# Altium schematic sheet System_architecture.SchDoc
size A3; SheetNumber: 1; SheetTotal: 1
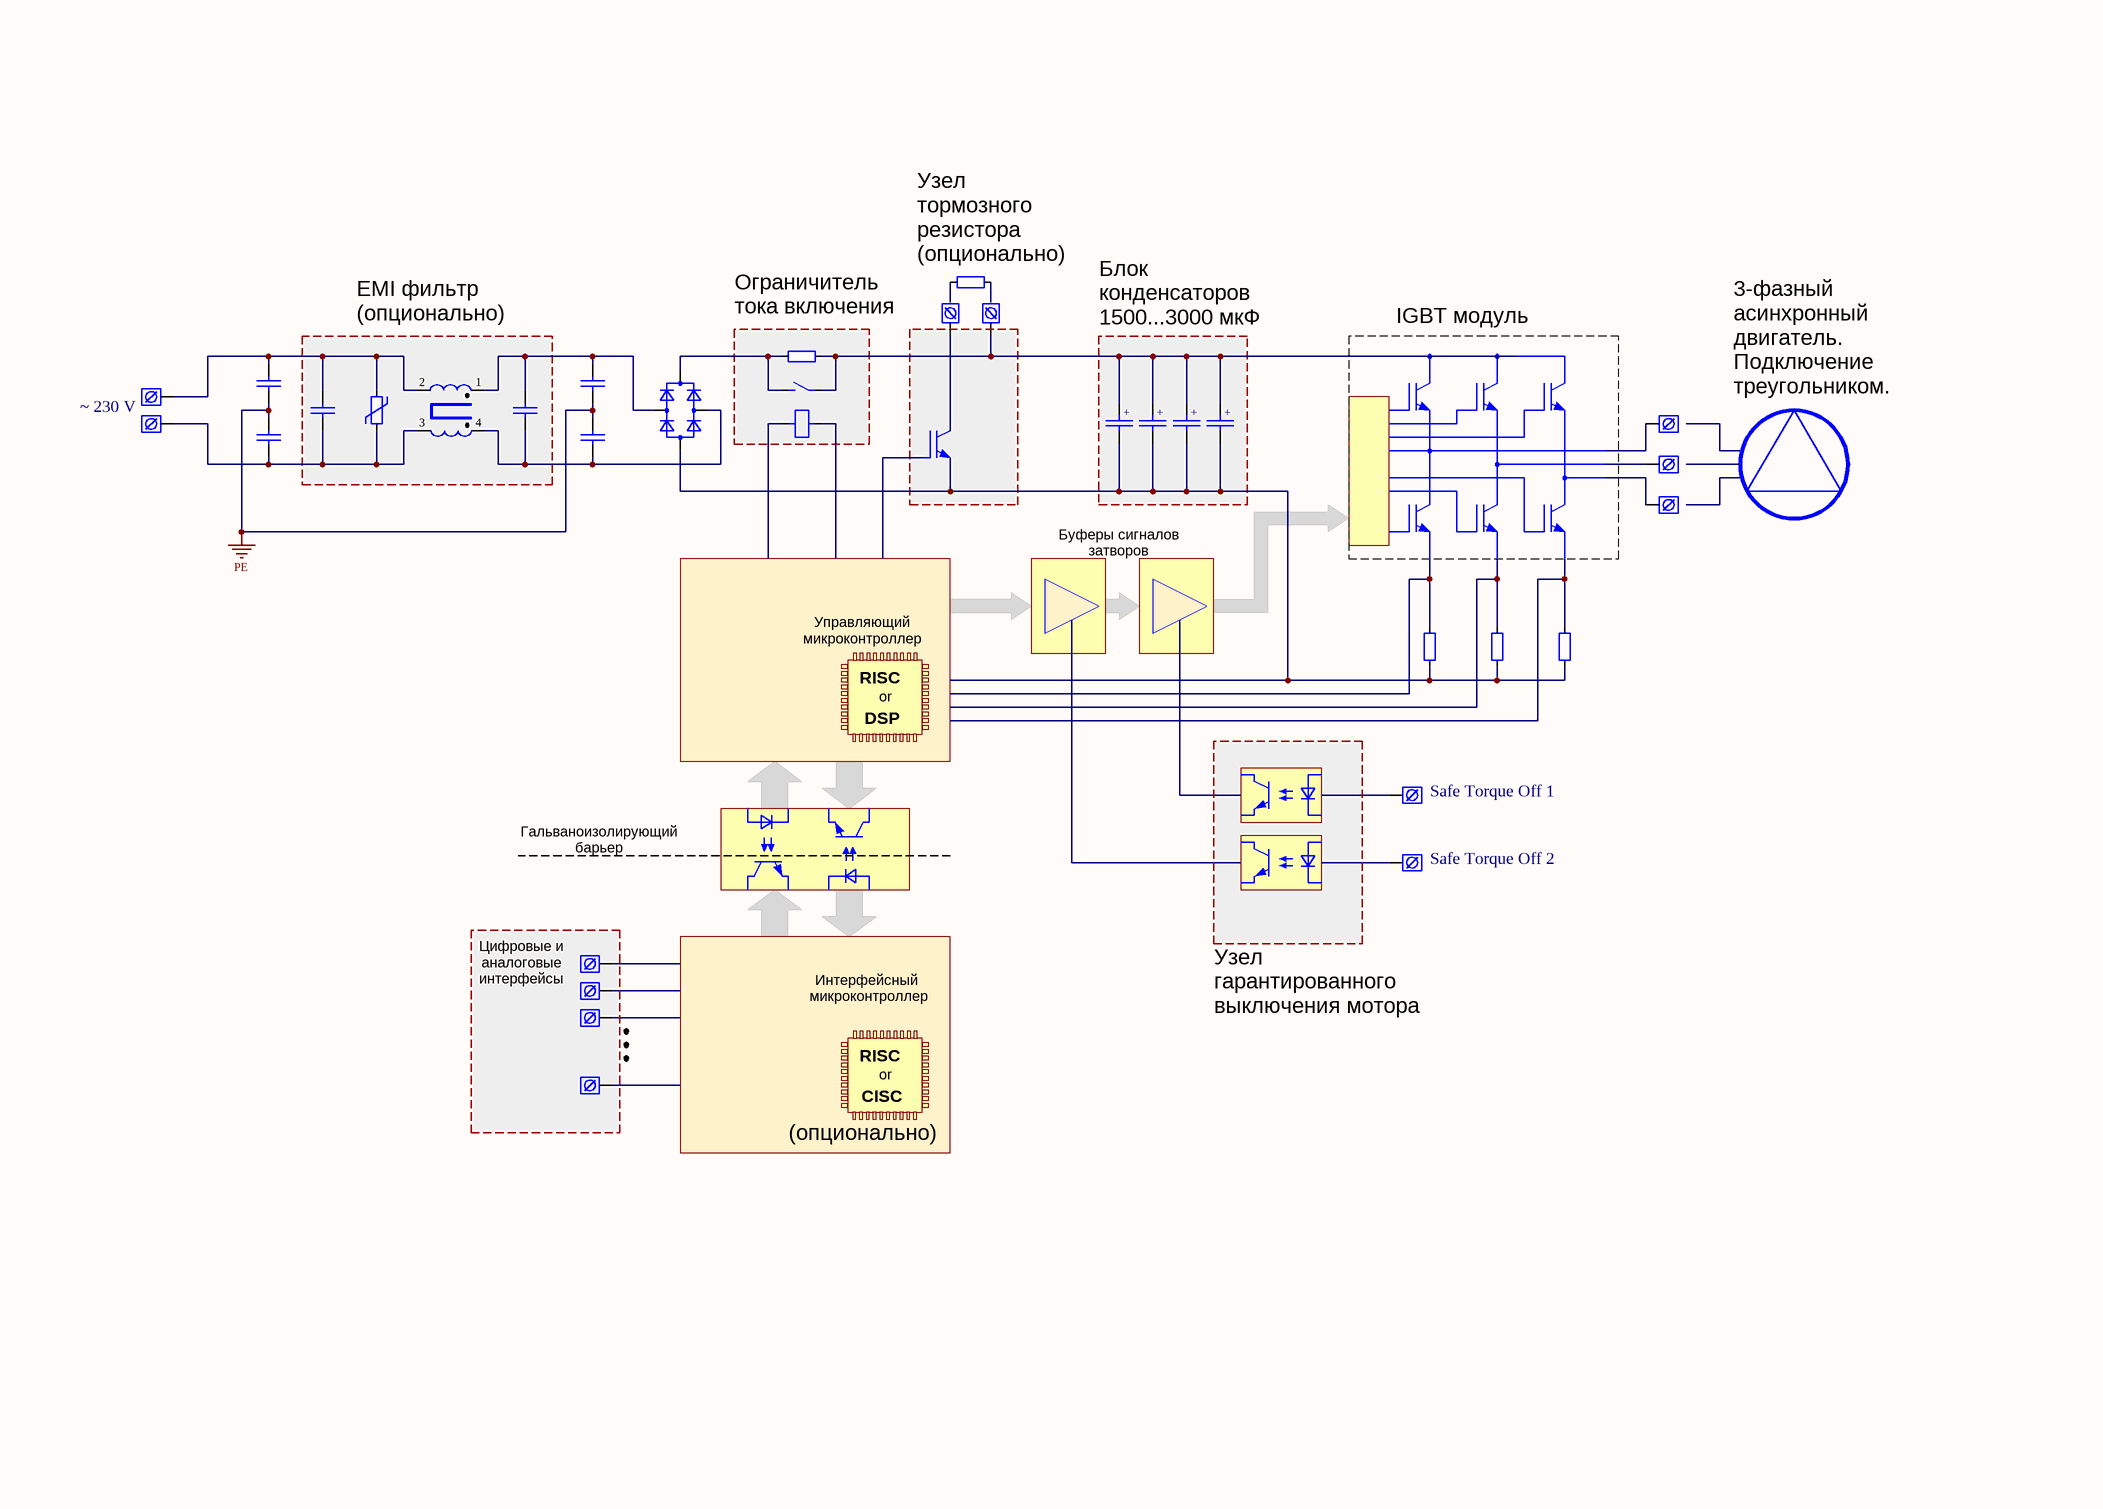
[diagram p0: System_architecture.SchDoc]

## Parts
(Parts that share a designator on the sheet are numbered #1, #2 ... from top to bottom, then left to right.)
*  IGBT_module  (value not drawn)
C1  DE2E3KH472MA3B  [DE2E3KH472M]  (value not drawn)
C2  CY2V-1N5  [CY2V-1N5]  (value not drawn)
C3  JFV-220N/275-P15  [JFV-220N/275-P15]  (value not drawn)
C4  JFV-330N/275-P15  [JFV-330N/275-P15]  (value not drawn)
C5  DE2E3KH472MA3B  [DE2E3KH472M]  (value not drawn)
C6  CY2V-1N5  [CY2V-1N5]  (value not drawn)
C?#1  ESMH451VNN471MA50T  [ESMH451VNN471MA50T]  (value not drawn)
C?#2  ESMH451VNN471MA50T  [ESMH451VNN471MA50T]  (value not drawn)
C?#3  ESMH451VNN471MA50T  [ESMH451VNN471MA50T]  (value not drawn)
C?#4  ESMH451VNN471MA50T  [ESMH451VNN471MA50T]  (value not drawn)
D?  2W04GM  [2W04GM]  (value not drawn)
K1  V23047-A1024-A511  [SR2M]  (value not drawn)  (parts A,B of 3)
K?#1  KEYS7692  [KEYS7692]  (value not drawn)
K?#2  KEYS7692  [KEYS7692]  (value not drawn)
K?#3  KEYS7692  [KEYS7692]  (value not drawn)
K?#4  KEYS7692  [KEYS7692]  (value not drawn)
K?#5  KEYS7692  [KEYS7692]  (value not drawn)
K?#6  KEYS7692  [KEYS7692]  (value not drawn)
K?#7  KEYS7692  [KEYS7692]  (value not drawn)
K?#8  KEYS7692  [KEYS7692]  (value not drawn)
K?#9  KEYS7692  [KEYS7692]  (value not drawn)
K?#10  KEYS7692  [KEYS7692]  (value not drawn)
K?#11  KEYS7692  [KEYS7692]  (value not drawn)
K?#12  KEYS7692  [KEYS7692]  (value not drawn)
K?#13  KEYS7692  [KEYS7692]  (value not drawn)
L1  CMT-8120  [CMT-8120]  (value not drawn)
R1  ERZV14D471  [ERZ-V14D471]  (value not drawn)
R?#1  MCS3264R005FER  [MCS3264]  (value not drawn)
R?#2  MCS3264R005FER  [MCS3264]  (value not drawn)
R?#3  MCS3264R005FER  [MCS3264]  (value not drawn)
R?#4  MCS3264R005FER  [MCS3264]  (value not drawn)
R?#5  MCS3264R005FER  [MCS3264]  (value not drawn)

## Nets
PE: C1.2 C2.2 C5.1 C6.1
NetC1_1: C1.1 C4.1 K?#3.1 L1.2 R1.2
NetC2_1: C2.1 C3.1 D?.2(AC2) L1.1
NetC3_2: C3.2 C6.2 D?.4(AC1) L1.4
NetC4_2: C4.2 C5.2 K?#4.1 L1.3 R1.1
NetC?#1_1: C?#1.1 C?#2.1 C?#3.1 C?#4.1 K1.13 K?#2.1 R?#2.2
NetC?#1_2: C?#1.2 C?#2.2 C?#3.2 C?#4.2 D?.3(-) R?#3.1 R?#4.1 R?#5.1
NetD?_1: D?.1(+) K1.14 R?#2.1

Not connected (* = marked no-connect by the designer): K1 A1 A2; K?#1 1; K?#5 1; K?#6 1; K?#7 1; K?#8 1; K?#9 1; K?#10 1; K?#11 1; K?#12 1; K?#13 1; R?#1 1 2; R?#3 2; R?#4 2; R?#5 2

## Notes on the sheet
- (near R?#1) Text
- Ограничитель тока включения
- (near R?#1) Узел тормозного резистора
  (опционально)
- EMI фильтр
  (опционально)
- Блок конденсаторов 1500...3000 мкФ
- IGBT модуль
- (near K?#3) ~ 230 V
- 3-фазный асинхронный двигатель.
  Подключение треугольником.
- Буферы сигналов затворов
- Управляющий микроконтроллер
- RISC
- DSP
- or
- Гальваноизолирующий барьер
- (near K?#8) Safe Torque Off 1
- (near K?#9) Safe Torque Off 2
- (near K?#10) Цифровые и аналоговые интерфейсы
- Интерфейсный
  микроконтроллер
- Узел гарантированного выключения мотора
- CISC
- (опционально)
- (in symbol ESMH451VNN471MA50T) +

## Library data of the parts
C1 C5 = DE2E3KH472MA3B: CAP CER X1,Y2 4700PF 20% 250VAC,  THT 7.5mm; X1,Y2; Manufacturer: Murata; Value: 4.7nF; Distributor: TME; PartNum: CMT-8120; Price: 0.622; Link: http://www.tme.eu/lt/details/de2e3kh472ma3b/keraminiai-trukdsiu-slopinimo-kondensat/murata/#; Tolerance: 20%; PartName: DE2E3KH472MA3B; Voltage: 250VAC
C2 C6 = CY2V-1N5: CAP CER 1500PF 20% 250VAC,  THT 7.5mm;  dimeter 8mm, X1,Y2; Value: 1.5nF; Distributor: TME; PartNum: CY2V-1N5; Price: 0.253; Link: http://www.tme.eu/lt/details/cy2v-1n5/keraminiai-trukdsiu-slopinimo-kondensat/#; Tolerance: 20%; PartName: CY2V-1N5; Voltage: 250VAC
C3 = JFV-220N/275-P15: CAP X2, 220nF; 15mm; ±10%; 18x6x12mm; Manufacturer: JB CAPACITORS; Voltage: 275VAC; Distributor: TME; PartNum: JFV-220N/275-P15; Price: 0.422; Link: http://www.tme.eu/lt/details/jfv-220n_275-p15/polipropileno-kondensatoriai-x2y2/jb-capacitors/#; Tolerance: 10%; PartName: JFV-220N/275-P15; Value: 220nF
C4 = JFV-330N/275-P15: CAP X2, 330nF, 275V, ±10%; 18x10x15.8mm; Manufacturer: JB CAPACITORS; Voltage: 275VAC; Distributor: TME; PartNum: JFV-330N/275-P15; Price: 0.448; Link: http://www.tme.eu/lt/details/jfv-330n_275-p15/polipropileno-kondensatoriai-x2y2/jb-capacitors/#; Tolerance: 10%; PartName: JFV-330N/275-P15; Value: 330nF
C?#1-C?#4 = ESMH451VNN471MA50T: 470uF 450V, 20%, -40..+85, 2000 Hrs @ 85°C, 35*50; Manufacturer: UNITED CHEMICON; Tolerance: +-20%; Distributor: Future; Price: 3 Euro; PartNum: ESMH451VNN471MA50T; PartName: ESMH451VNN471MA50T; Value: 470 uF; Voltage: 450 V
D? = 2W04GM: Bridge Rect. 2A 280V(RMS)
K1 = V23047-A1024-A511: RELAY GEN PURPOSE DPST 8A 24V; PartNum: PB660-ND; Manufacturer: TE Connectivity Potter & Brumfield Relays; Distributor: Digi-Key; Price: 7.79$; PartName: V23047-A1024-A511
K?#1-K?#13 = KEYS7692: Screw terminal KEYS7692; Manufacturer: KEYSTONE; Distributor: TME; Price: 0.32 Euro; PartNum: KEYS7692; PartName: KEYS7692
L1 = CMT-8120: INDUCTOR 2.4MH COMMON MODE VERT, 17A; Manufacturer: Triad Magnetics; PartNum: 237-1373-ND; Distributor: Digi-Key; Price: 10.96$; Value: 2.4mH; Link: http://www.digikey.com/product-detail/en/CMT-8120/237-1373-ND/2783628; PartName: CMT-8120
R1 = ERZV14D471: VARISTOR Disc 14mm, 6kA, 175J,; Manufacturer: PANASONIC; Voltage: 470V; Distributor: Farnell; PartNum: ERZV14D471; Price: 2.08; Link: http://lt.farnell.com/jsp/displayProduct.jsp?sku=1845474&action=view&CMP=GRHS-1000755; PartName: ERZV14D471
R?#1-R?#5 = MCS3264R005FER: Curr.sens.res. 0.005 OHM 2W 1% , 2512 (6432 Metric); Manufacturer: Ohmite; PartNum: MCS3264R005FERCT-ND; Value: 0.005; Distributor: Digi-Key; Price: 0.3$; Tolerance: 1%; PartName: MCS3264R005FER; Price50: 0.3$